# Altium schematic sheet Energia_1_CubeSat Smashboy 2020.SchDoc
size A0; Organization: Altium Limited; Address1: L3, 12a Rodborough Rd; Address2: Frenchs Forest; Address3: NSW; Address4: Australia 2086
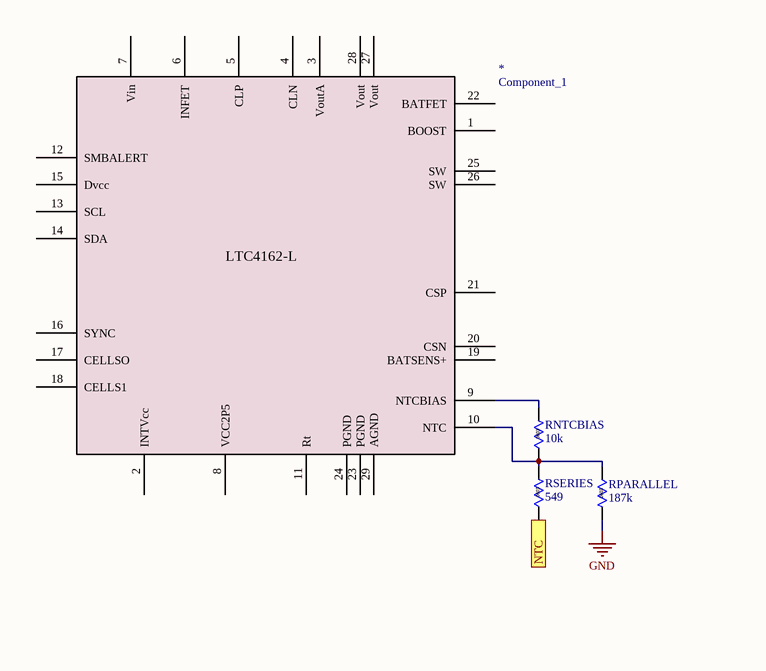
[diagram p0: Energia_1_CubeSat Smashboy 2020.SchDoc, top left]
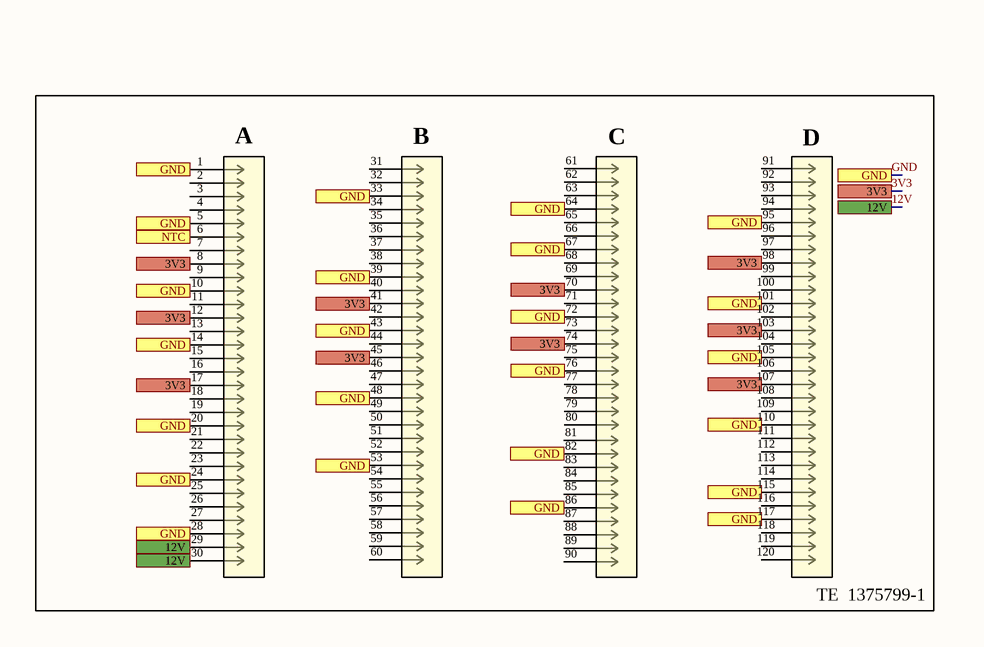
[diagram p1: Energia_1_CubeSat Smashboy 2020.SchDoc, bottom right]

## Parts
*  Component_1  [PCBComponent_1]  (no BOM)
J?  1375799-1  [CONN_1375799-1_T]  (value not drawn)  (part A of 3)
RNTCBIAS  10k  [RES0603]
RPARALLEL  187k  [RES0603]
RSERIES  549  [RES0603]

## Ports
3V3, 12V, GND, NTC

## Nets
GND: J?.1 J?.5 J?.10 J?.14 J?.20 J?.24 J?.28 J?.33 J?.39 J?.43 J?.48 J?.53 J?.64 J?.67 J?.72 J?.76 J?.82 J?.86 J?.95 J?.101 J?.105 J?.110 J?.115 J?.117 RPARALLEL.1 ; port GND
3V3: J?.8 J?.12 J?.17 J?.41 J?.45 J?.70 J?.74 J?.98 J?.103 J?.107 ; port 3V3
12V: J?.29 J?.30 ; port 12V
NTC: J?.6 RSERIES.1 ; port NTC
Net*_9: *.9(NTCBIAS) RNTCBIAS.2
Net*_10: *.10(NTC) RNTCBIAS.1 RPARALLEL.2 RSERIES.2

Not connected (* = marked no-connect by the designer): * 1(BOOST) 2(INTVcc) 3(VoutA) 4(CLN) 5(CLP) 6(INFET) 7(Vin) 8(VCC2P5) 11(Rt) 12(SMBALERT) 13(SCL) 14(SDA) 15(Dvcc) 16(SYNC) 17(CELLSO) 18(CELLS1) 19(BATSENS+) 20(CSN) 21(CSP) 22(BATFET) 23(PGND) 24(PGND) 25(SW) 26(SW) 27(Vout) 28(Vout) 29(AGND); J? 2 3 4 7 9 11 13 15 16 18 19 21 22 23 25 26 27 31 32 34 35 36 37 38 40 42 44 46 47 49 50 51 52 54 55 56 57 58 59 60 61(21) 62(22) 63(23) 65(25) 66 68 69 71 73 75 77 78(38) 79 80 81 83 84 85 87 88 89 90 91 92 93 94 96 97 99 100 102 104 106 108 109 111 112 113 114 116 118 119 120

## Notes on the sheet
- Title
- Size:
- Date:
- File:
- A0
- Number:
- Time:
- Revision:
- Sheet
- of
- (in symbol 1375799-1, part A) A; B; C; D; TE  1375799-1
- (in symbol Component_1) LTC4162-L
- (in symbol RES0603) 0603

## Library data of the parts
J? = 1375799-1: No Description Available; Vendor: TE Connectivity; Built_By: EMA_UL_Team; SourceLibrary: Tyco_2012-1-03; Manufacturer_Part_Number: 1375799-1; Copyright: Copyright (C) 2016 Accelerated Designs. All rights reserved; RefDes: RefDes; Type: DEV
RNTCBIAS RPARALLEL RSERIES = RES0603: Resistor SMD 0603